# Altium schematic sheet Sheet1.SchDoc
size A4; SheetNumber: 1; SheetTotal: 3
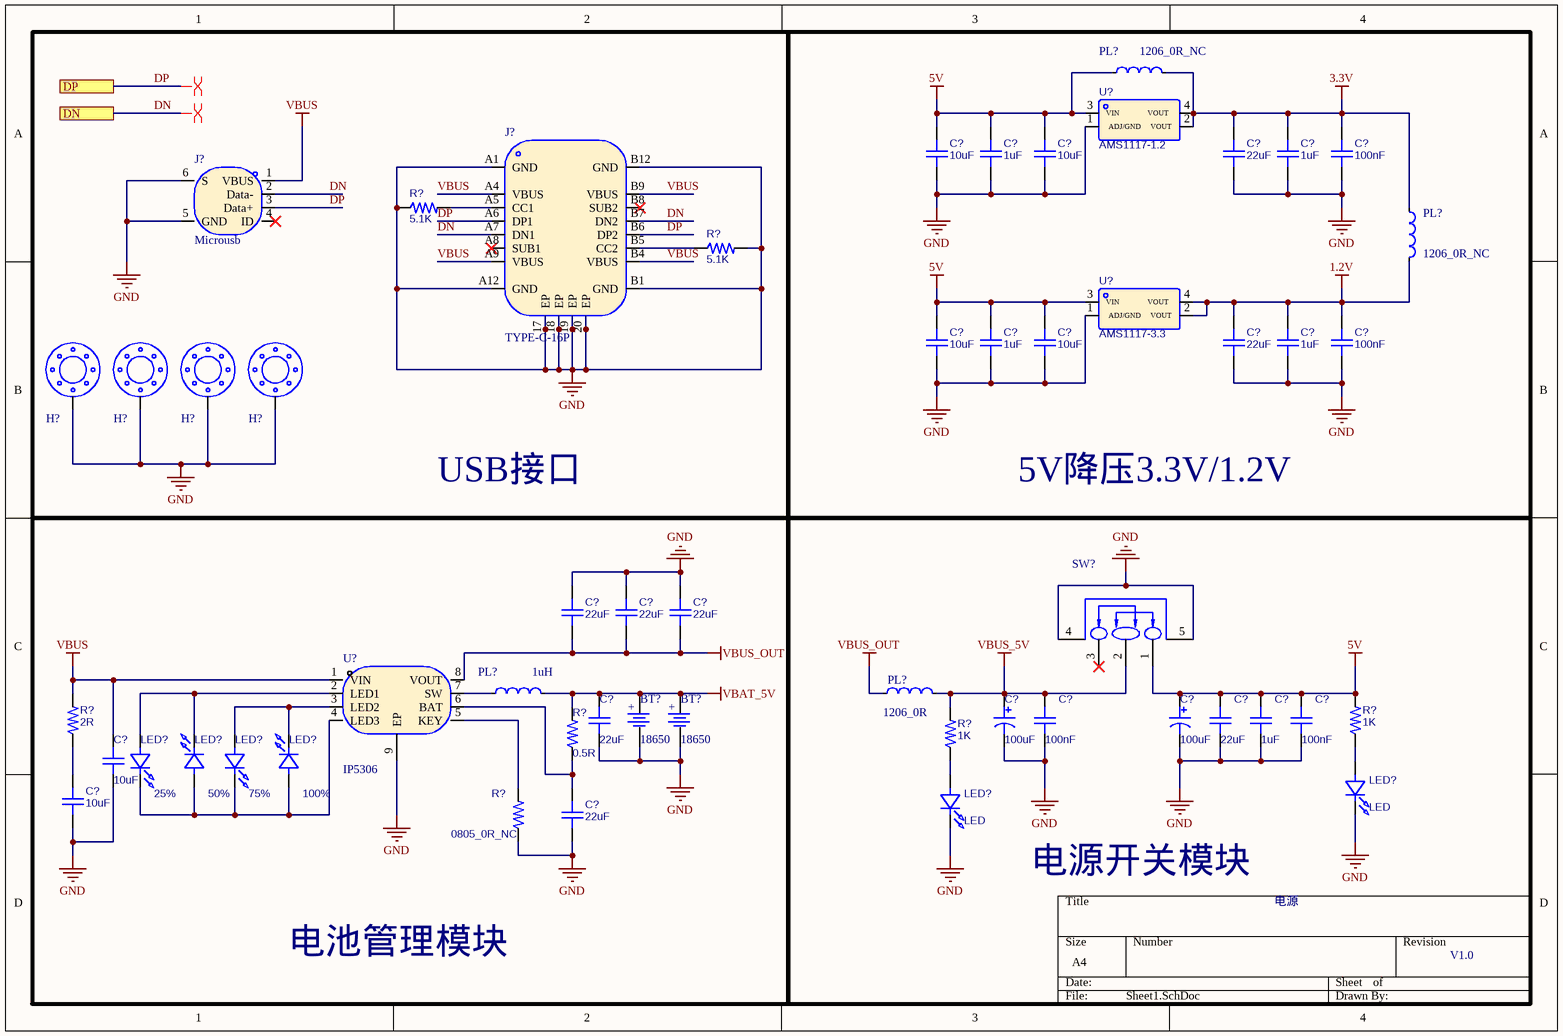
[diagram p0: Sheet1.SchDoc]

## Parts
(Parts that share a designator on the sheet are numbered #1, #2 ... from top to bottom, then left to right.)
BT?#1  18650  [BAT-SMD-18650]
BT?#2  18650  [BAT-SMD-18650]
C?#1  10uF  [CAP-SMD-0603]
C?#2  1uF  [CAP-SMD-0603]
C?#3  10uF  [CAP-SMD-0603]
C?#4  22uF  [CAP-SMD-0603]
C?#5  1uF  [CAP-SMD-0603]
C?#6  100nF  [CAP-SMD-0603]
C?#7  10uF  [CAP-SMD-0603]
C?#8  1uF  [CAP-SMD-0603]
C?#9  10uF  [CAP-SMD-0603]
C?#10  22uF  [CAP-SMD-0603]
C?#11  1uF  [CAP-SMD-0603]
C?#12  100nF  [CAP-SMD-0603]
C?#13  22uF  [CAP-SMD-0603]
C?#14  22uF  [CAP-SMD-0603]
C?#15  22uF  [CAP-SMD-0603]
C?#16  22uF  [CAP-SMD-0603]
C?#17  100uF  [CAPA-TH-5020-P2.0]
C?#18  100nF  [CAP-SMD-0603]
C?#19  100uF  [CAPA-TH-5020-P2.0]
C?#20  22uF  [CAP-SMD-0603]
C?#21  1uF  [CAP-SMD-0603]
C?#22  100nF  [CAP-SMD-0603]
C?#23  10uF  [CAP-SMD-0603]
C?#24  10uF  [CAP-SMD-0603]
C?#25  22uF  [CAP-SMD-0603]
H?#1  M3  [M3-5030-0.3]  (value not drawn)
H?#2  M3  [M3-5030-0.3]  (value not drawn)
H?#3  M3  [M3-5030-0.3]  (value not drawn)
H?#4  M3  [M3-5030-0.3]  (value not drawn)
J?#1  Microusb  [Microusb-SMD-5P]
J?#2  TYPE-C-16P  [TYPE-C-SMD-16P]
LED?#1  25%  [LED-SMD-0805]
LED?#2  50%  [LED-SMD-0805]
LED?#3  75%  [LED-SMD-0805]
LED?#4  100%  [LED-SMD-0805]
LED?#5  LED  [LED-SMD-0805]
LED?#6  LED  [LED-SMD-0805]
PL?#1  1206_0R_NC  [PL-SMD_4.4X4.2-P3.7]
PL?#2  1206_0R_NC  [PL-SMD_4.4X4.2-P3.7]
PL?#3  1uH  [PL-SMD_4.4X4.2-P3.7]
PL?#4  1206_0R  [PL-SMD_4.4X4.2-P3.7]
R?#1  5.1K  [RES-SMD-0603]
R?#2  5.1K  [RES-SMD-0603]
R?#3  2R  [RES-SMD-0603]
R?#4  1K  [RES-SMD-0603]
R?#5  0.5R  [RES-SMD-0603]
R?#6  1K  [RES-SMD-0603]
R?#7  0805_0R_NC  [RES-SMD-0603]
SW?  SS-12D11G5  [SW-TH-D-P4.8]  (value not drawn)
U?#1  AMS1117-1.2  [SOT-223-4-LP5.7-P2.3]
U?#2  AMS1117-3.3  [SOT-223-4-LP5.7-P2.3]
U?#3  IP5306  [ESOP-8-LP5.3-P1.27]

## Blocks framed on the sheet
USB接口: H?#1-H?#4 J?#1 J?#2 R?#1 R?#2
5V降压3.3V/1.2V: C?#1-C?#12 PL?#1 PL?#2 U?#1 U?#2
电池管理模块: BT?#1 BT?#2 C?#13-C?#16 C?#23-C?#25 LED?#1-LED?#4 PL?#3 R?#3 R?#5 R?#7 U?#3
电源开关模块: C?#17-C?#22 LED?#5 LED?#6 PL?#4 R?#4 R?#6 SW?

## Ports
DN, DP

## Nets
1.2V: C?#10.2 C?#11.2 C?#12.2 PL?#2.2 U?#2.2(VOUT) U?#2.4(VOUT)
3.3V: C?#4.2 C?#5.2 C?#6.2 PL?#1.2 PL?#2.1 U?#1.2(VOUT) U?#1.4(VOUT)
5V: C?#1.2 C?#2.2 C?#3.2 C?#7.2 C?#8.2 C?#9.2 C?#19.1 C?#20.2 C?#21.2 C?#22.2 PL?#1.1 R?#4.2 SW?.1 U?#1.3(VIN) U?#2.3(VIN)
GND: BT?#1.2(+) BT?#2.2(+) C?#1.1 C?#2.1 C?#3.1 C?#4.1 C?#5.1 C?#6.1 C?#7.1 C?#8.1 C?#9.1 C?#10.1 C?#11.1 C?#12.1 C?#13.2 C?#14.2 C?#15.2 C?#16.1 C?#17.2 C?#18.1 C?#19.2 C?#20.1 C?#21.1 C?#22.1 C?#23.1 C?#24.1 C?#25.1 H?#1.1 H?#2.1 H?#3.1 H?#4.1 J?#1.5(GND) J?#1.6(S) J?#2.17(EP) J?#2.18(EP) J?#2.19(EP) J?#2.20(EP) J?#2.A1(GND) J?#2.A12(GND) J?#2.B1(GND) J?#2.B12(GND) LED?#5.2(K) LED?#6.2(K) R?#1.1 R?#2.2 R?#7.1 SW?.4 SW?.5 U?#1.1(ADJ/GND) U?#2.1(ADJ/GND) U?#3.9(EP)
VBAT_5V: BT?#1.1(-) BT?#2.1(-) C?#16.2 PL?#3.2 R?#5.2
VBUS: C?#23.2 J?#1.1(VBUS) J?#2.A4(VBUS) J?#2.A9(VBUS) J?#2.B4(VBUS) J?#2.B9(VBUS) R?#3.2 U?#3.1(VIN)
VBUS_5V: C?#17.1 C?#18.2 PL?#4.2 R?#6.2 SW?.2
VBUS_OUT: C?#13.1 C?#14.1 C?#15.1 PL?#4.1 U?#3.8(VOUT)
DN: J?#1.2(Data-) J?#2.A7(DN1) J?#2.B7(DN2) ; port DN
DP: J?#1.3(Data+) J?#2.A6(DP1) J?#2.B6(DP2) ; port DP
NetC?#24_2: C?#24.2 R?#3.1
NetC?#25_2: C?#25.2 R?#5.1 U?#3.6(BAT)
NetJ?#2_A5: J?#2.A5(CC1) R?#1.2
NetJ?#2_B5: J?#2.B5(CC2) R?#2.1
NetLED?#1_1: LED?#1.1(A) LED?#2.2(K) U?#3.2(LED1)
NetLED?#1_2: LED?#1.2(K) LED?#2.1(A) LED?#3.2(K) LED?#4.1(A) U?#3.4(LED3)
NetLED?#3_1: LED?#3.1(A) LED?#4.2(K) U?#3.3(LED2)
NetLED?#5_1: LED?#5.1(A) R?#4.1
NetLED?#6_1: LED?#6.1(A) R?#6.1
NetPL?#3_1: PL?#3.1 U?#3.7(SW)
NetR?#7_2: R?#7.2 U?#3.5(KEY)

Not connected (* = marked no-connect by the designer): J?#1 4(ID)*; J?#2 A8(SUB1)* B8(SUB2)*; SW? 3*

## Layout directives
differential pair: DN, DP

## Notes on the sheet
- 电源
- V1.0

## Library data of the parts
BT?#1 BT?#2 = CR2032: 纽扣电池CR2032-BS-6-1; Manufacturer: Q&J; Add into BOM: yes; Connector Type: 电池底座; Symbol: CR2032-BS-6-1; Device: CR2032-BS-6-1; LCSC Part Name: 电池底座 适用电池:CR2032; Supplier Part: C70377; Manufacturer Part: CR2032-BS-6-1; Supplier Footprint: SMD; JLCPCB Part Class: Extended Part; Datasheet: https://atta.szlcsc.com/upload/public/pdf/source/20160427/1461725216549.pdf; Supplier: LCSC; Convert to PCB: yes; Battery Type: CR2032; Operating Temperature Range: -
C?#1-C?#16 C?#18 C?#20-C?#25 = CAP: 贴片电容; BOM_Manufacturer: SAMSUNG; BOM_Manufacturer Part: CL03A104KQ3NNNC; nameAlias: Capacitance; Contributor: LCSC; BOM_Supplier: LCSC; BOM_Supplier Part: C160831; BOM_JLCPCB Part Class: Extended Part; spicePre: C; spiceSymbolName: CL03A104KQ3NNNC
C?#17 C?#19 = CAPA: 电解电容; BOM_Manufacturer: ValuePro; BOM_Manufacturer Part: 普通黑色470UF 50V; nameAlias: Capacitance; BOM_Supplier: LCSC; BOM_Supplier Part: C34642; BOM_JLCPCB Part Class: Extended Part; spicePre: C; spiceSymbolName: 470UF 50V
H?#1-H?#4 = M3: M3螺丝孔
J?#1 = Microusb-5P: 安卓阶梯型USB接口; Manufacturer: Amphenol; Symbol: 10118194-0001LF; Add into BOM: yes; Connector Type: Micro-B; Gender: 母座; Number of Contacts: 5; Number of Ports: 1; Device: 10118194-0001LF; LCSC Part Name: Micro-B 母座; Supplier Part: C132563; Manufacturer Part: 10118194-0001LF; Supplier Footprint: SMD; JLCPCB Part Class: Extended Part; Datasheet: https://atta.szlcsc.com/upload/public/pdf/source/20210630/C132563_323781699BE9D7BFAD8DF70EA5820798.pdf; Supplier: LCSC; Convert to PCB: yes; Standard: USB 2.0
J?#2 = TYPE-C-16P: TYPE-C-16pin; Manufacturer: kinghelm(金航标); Symbol: KH-TYPE-C-16P; Add into BOM: yes; Connector Type: Type-C; Gender: 母座; Number of Contacts: 16; Number of Ports: 1; Current Rating - Power (Max): 3A; Device: KH-TYPE-C-16P; LCSC Part Name: Type-C 母座 卧贴; Supplier Part: C709357; Manufacturer Part: KH-TYPE-C-16P; Supplier Footprint: SMD; JLCPCB Part Class: Extended Part; Datasheet: https://atta.szlcsc.com/upload/public/pdf/source/20200911/C709357_AA8DCEB38BB20E3035A7ED7AE7667837.pdf; Supplier: LCSC; Convert to PCB: yes; Standard: -; Mounting Style: 卧贴; Operating Temperature Range: -40~+85
LED?#1-LED?#6 = LED: LED灯,发光二极管; BOM_Manufacturer: yongyu(永裕光电); BOM_Manufacturer Part: SZYY0402B; Contributor: LCSC; BOM_Supplier: LCSC; BOM_Supplier Part: C434447; spicePre: L; spiceSymbolName: SZYY0402B
PL?#1-PL?#4 = PL-IND: 电感; Manufacturer: Sunlord(顺络); Symbol: GZ1608D121TF-C12391; Device: GZ1608D121TF; Add into BOM: yes; Impedance @ Frequency: 120Ω@100MHz; Tolerance: ±25%; DC Resistance: 200mΩ; Current Rating: 300mA; Circuits: 1; LCSC Part Name: 120Ω@100MHz ±25%; Supplier Part: C12391; Manufacturer Part: GZ1608D121TF; Supplier Footprint: 0603; JLCPCB Part Class: Extended Part; Datasheet: https://atta.szlcsc.com/upload/public/pdf/source/20210830/355EA7C0FAC5394FC0FE3F17C770C20A.pdf; Supplier: LCSC; Convert to PCB: yes
R?#1-R?#7 = RES: 贴片电阻; BOM_Manufacturer: Chengdu Guosheng Tech; BOM_Manufacturer Part: 3362P-1-104; Resistance(Ohms): 100K; nameAlias: Resistance; Contributor: LCSC; BOM_Supplier: LCSC; BOM_Supplier Part: C118966; Resistance (Ohms): 100K; BOM_JLCPCB Part Class: Extended Part; spicePre: R; spiceSymbolName: 3362P-1-104_C118966
SW? = SW-D-3P: 额定电流(DC)：3A 额定电压(DC)：125V 额定电流(AC)：3A 额定电压(AC)：125V; Manufacturer: XKB Connectivity(中国星坤); Add into BOM: yes; Current Rating (DC): 3A; Voltage Rating (DC): 125V; Circuit: 单刀双掷; Mechanical Life: 10000; Actuator Color: 黑色; Actuator Style: 矩形柱状; Pin Style: PC引脚; Switch Length: 13.5mm; Switch Width: 6.6mm; Switch Height: 6.3mm; Name: SS-12D11G5; Symbol: SS-12D11G5; Device: SS-12D11G5; LCSC Part Name: SS-12D11G5; Supplier Part: C692484; Manufacturer Part: SS-12D11G5; Supplier Footprint: 插件; JLCPCB Part Class: 扩展库; Datasheet: https://atta.szlcsc.com/upload/public/pdf/source/20211009/84F89DEF741E27E9E55DE4039DC07CAD.pdf; Supplier: LCSC; Convert to PCB: yes; Current Rating (AC): 3A; Voltage Rating (AC): 125V; Mounting Style: 弯插; Operating Temperature: -40~+85
U?#1 = AMS1117-5.0: 稳压器芯片; BOM_Manufacturer: JSMSEMI(杰盛微); Contributor: LCSC; BOM_Supplier: LCSC; BOM_Supplier Part: C2718490; BOM_Manufacturer Part: AMS1117-5.0; BOM_JLCPCB Part Class: Extended Part; spicePre: U; spiceSymbolName: AMS1117-5.0_C2718490
U?#2 = AMS1117-5.0_1: 稳压器芯片; BOM_Manufacturer: JSMSEMI(杰盛微); Contributor: LCSC; BOM_Supplier: LCSC; BOM_Supplier Part: C2718490; BOM_Manufacturer Part: AMS1117-5.0; BOM_JLCPCB Part Class: Extended Part; spicePre: U; spiceSymbolName: AMS1117-5.0_C2718490
U?#3 = IP5306: 充电电池的类型:-;电池单元组数:-;最大充电电流:-;充满的电池组电压:-;最大供应电压:-;; Manufacturer: INJOINIC(英集芯); Add into BOM: yes; Name: IP5306; Symbol: IP5306; Device: IP5306; LCSC Part Name: IP5306; Supplier Part: C181692; Manufacturer Part: IP5306; Supplier Footprint: ESOP-8; JLCPCB Part Class: 扩展库; Datasheet: https://atta.szlcsc.com/upload/public/pdf/source/20180920/C181692_842C9BF636DF123BB66E91FC1AD6F13F.pdf; Supplier: LCSC; Convert to PCB: yes; Battery Chemistry: -; Number of Cells: -; Charge Current - Max: -; Battery Pack Voltage: -; Voltage - Supply (Max): -; Interface: -